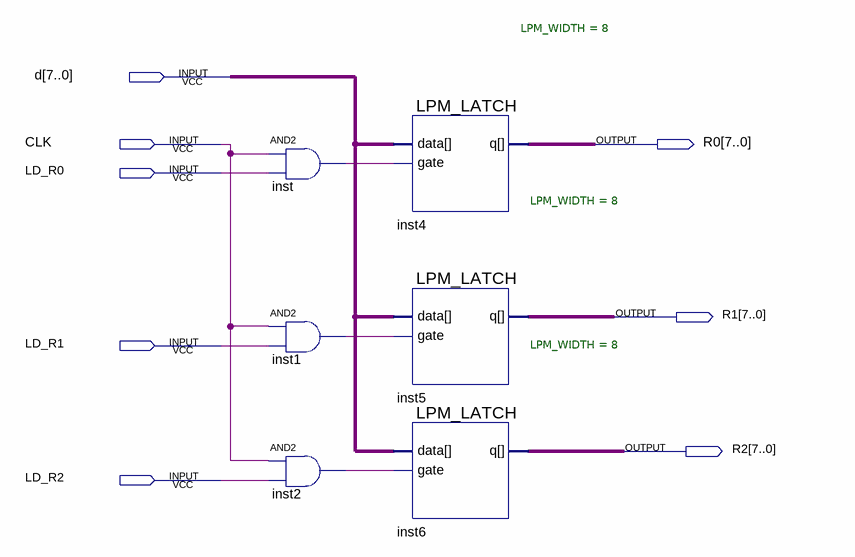
[diagram p0: schematic sheet]
// Quartus schematic REG0_2.bdf as structural Verilog: 6 symbols, 8 pins
module REG0_2 (
  input  [7:0] d,
  input  CLK,
  input  LD_R0,
  input  LD_R1,
  input  LD_R2,
  output [7:0] R0,
  output [7:0] R1,
  output [7:0] R2
);

  wire inst1_out, inst2_out, inst_out;

  and inst (inst_out, CLK, LD_R0);
  and inst1 (inst1_out, CLK, LD_R1);
  and inst2 (inst2_out, CLK, LD_R2);
  LPM_LATCH #(.LPM_WIDTH(8)) inst4 (.data(d), .gate(inst_out), .q(R0));
  LPM_LATCH #(.LPM_WIDTH(8)) inst5 (.data(d), .gate(inst1_out), .q(R1));
  LPM_LATCH #(.LPM_WIDTH(8)) inst6 (.data(d), .gate(inst2_out), .q(R2));
endmodule
